# EAGLE schematic ExpressionPedalAdapter (EAGLE 9.6.2)
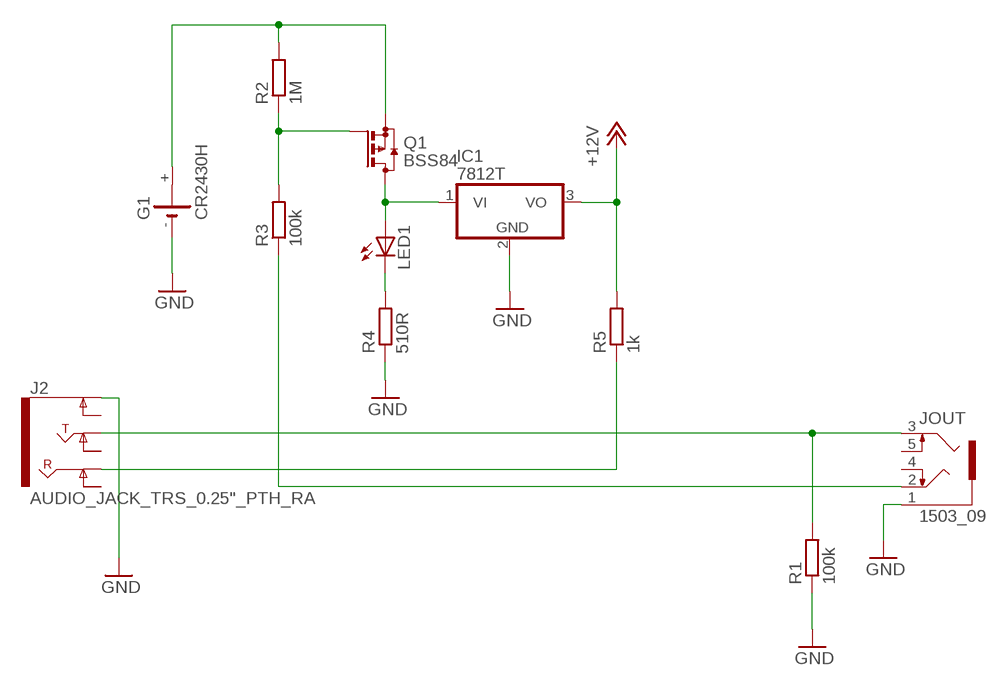
[diagram p0: schematic, sheet 1]

## Parts
G1  CR2430H  [CR2430H]
IC1  7812T  [TO220H]
J2  AUDIO_JACK_TRS_0.25"_PTH_RA  [AUDIO_JACK_0.25"_TRS_PTH_RA]
JOUT  1503_09  [1503_09]
LED1  LED3MM  [LED3MM]
Q1  BSS84  [SOT23]
R1  100k  R-EU_0204/7  [0204/7]
R2  1M  R-EU_0204/7  [0204/7]
R3  100k  R-EU_0204/7  [0204/7]
R4  510R  R-EU_0204/7  [0204/7]
R5  1k  R-EU_0204/7  [0204/7]

## Nets
+12V: IC1.3(VO) R5.2
GND: G1.- IC1.2(GND) J2.SLEEVE(EARTH) JOUT.1 R1.1 R4.1
N$1: G1.+ Q1.2(S) R2.2
N$2: IC1.1(VI) LED1.A Q1.3(D)
N$3: J2.TIP JOUT.3 R1.2
N$4: JOUT.2 R3.1
N$5: Q1.1(G) R2.1 R3.2
N$6: LED1.K(C) R4.2
N$7: J2.RING R5.1
Unconnected: G1.+@1(+) J2.RING-NORM J2.SLEEVE-NORM(EARTH-NORM) J2.TIP-NORM JOUT.4 JOUT.5

## Library data of the parts
G1 = battery:CR2430H: LI BATTERY Varta
IC1 = linear:78*: Positive VOLTAGE REGULATOR Source: http://cache.national.com/ds/LM/LM78L05.pdf http://www.fairchildsemi.com/ds/LM/LM7805.pdf
J2 = SparkFun-Connectors:AUDIO_JACK_TRS_0.25"_PTH_RA: Audio Jack, 1/4" TRS jack, horizontal, PTH, aka "Phono jack" Find the connector here: Audio Jack - 1/4" Stereo (right angle) <https://www.sparkfun.com/products/11144> (COM-11144) Datasheet <http://cdn.sparkfun.com/datasheets/Components/General/JP-611%20DD.jpg> Note, although the datasheet and physical part are slightly different, this footprint was proven to mate well on the Proto Pedal. This device is used on these SparkFun Products: SparkFun TRS Jack Breakout - 1/4" Stereo <https://www.sparkfun.com/products/13005> (BOB-13005 ) SparkFun Proto Pedal - sorry bad link - product comming soon! <https://www.sparkfun.com/products/13124> (PRT-13124); PROD_ID: CONN-12339; SF_ID: COM-11144
JOUT = con-lumberg:1503_09: Jack connectors according to JISC 6560, 3.5 mm Klinkeneinbaukupplung nach JISC 6560, 3,5 mm, 3-polig/ stereo, abgewinkelte Ausführung, mit 2 Öffnern und Lötaugen, für Leiterplatten Rückseitenmontage Source: http://www.lumberg.com/Produkte/PDFs/1503_09.pdf; OC_FARNELL: 1243244; OC_NEWARK: unknown
LED1 = Rebel:LED: LED
Q1 = transistor-small-signal:BSS84: P-CHANNEL MOS FET
R1-R5 = Rebel:R-EU_: RESISTOR, European symbol